# EAGLE design TSOC-ENCORE3 (EAGLE 6.6.0)
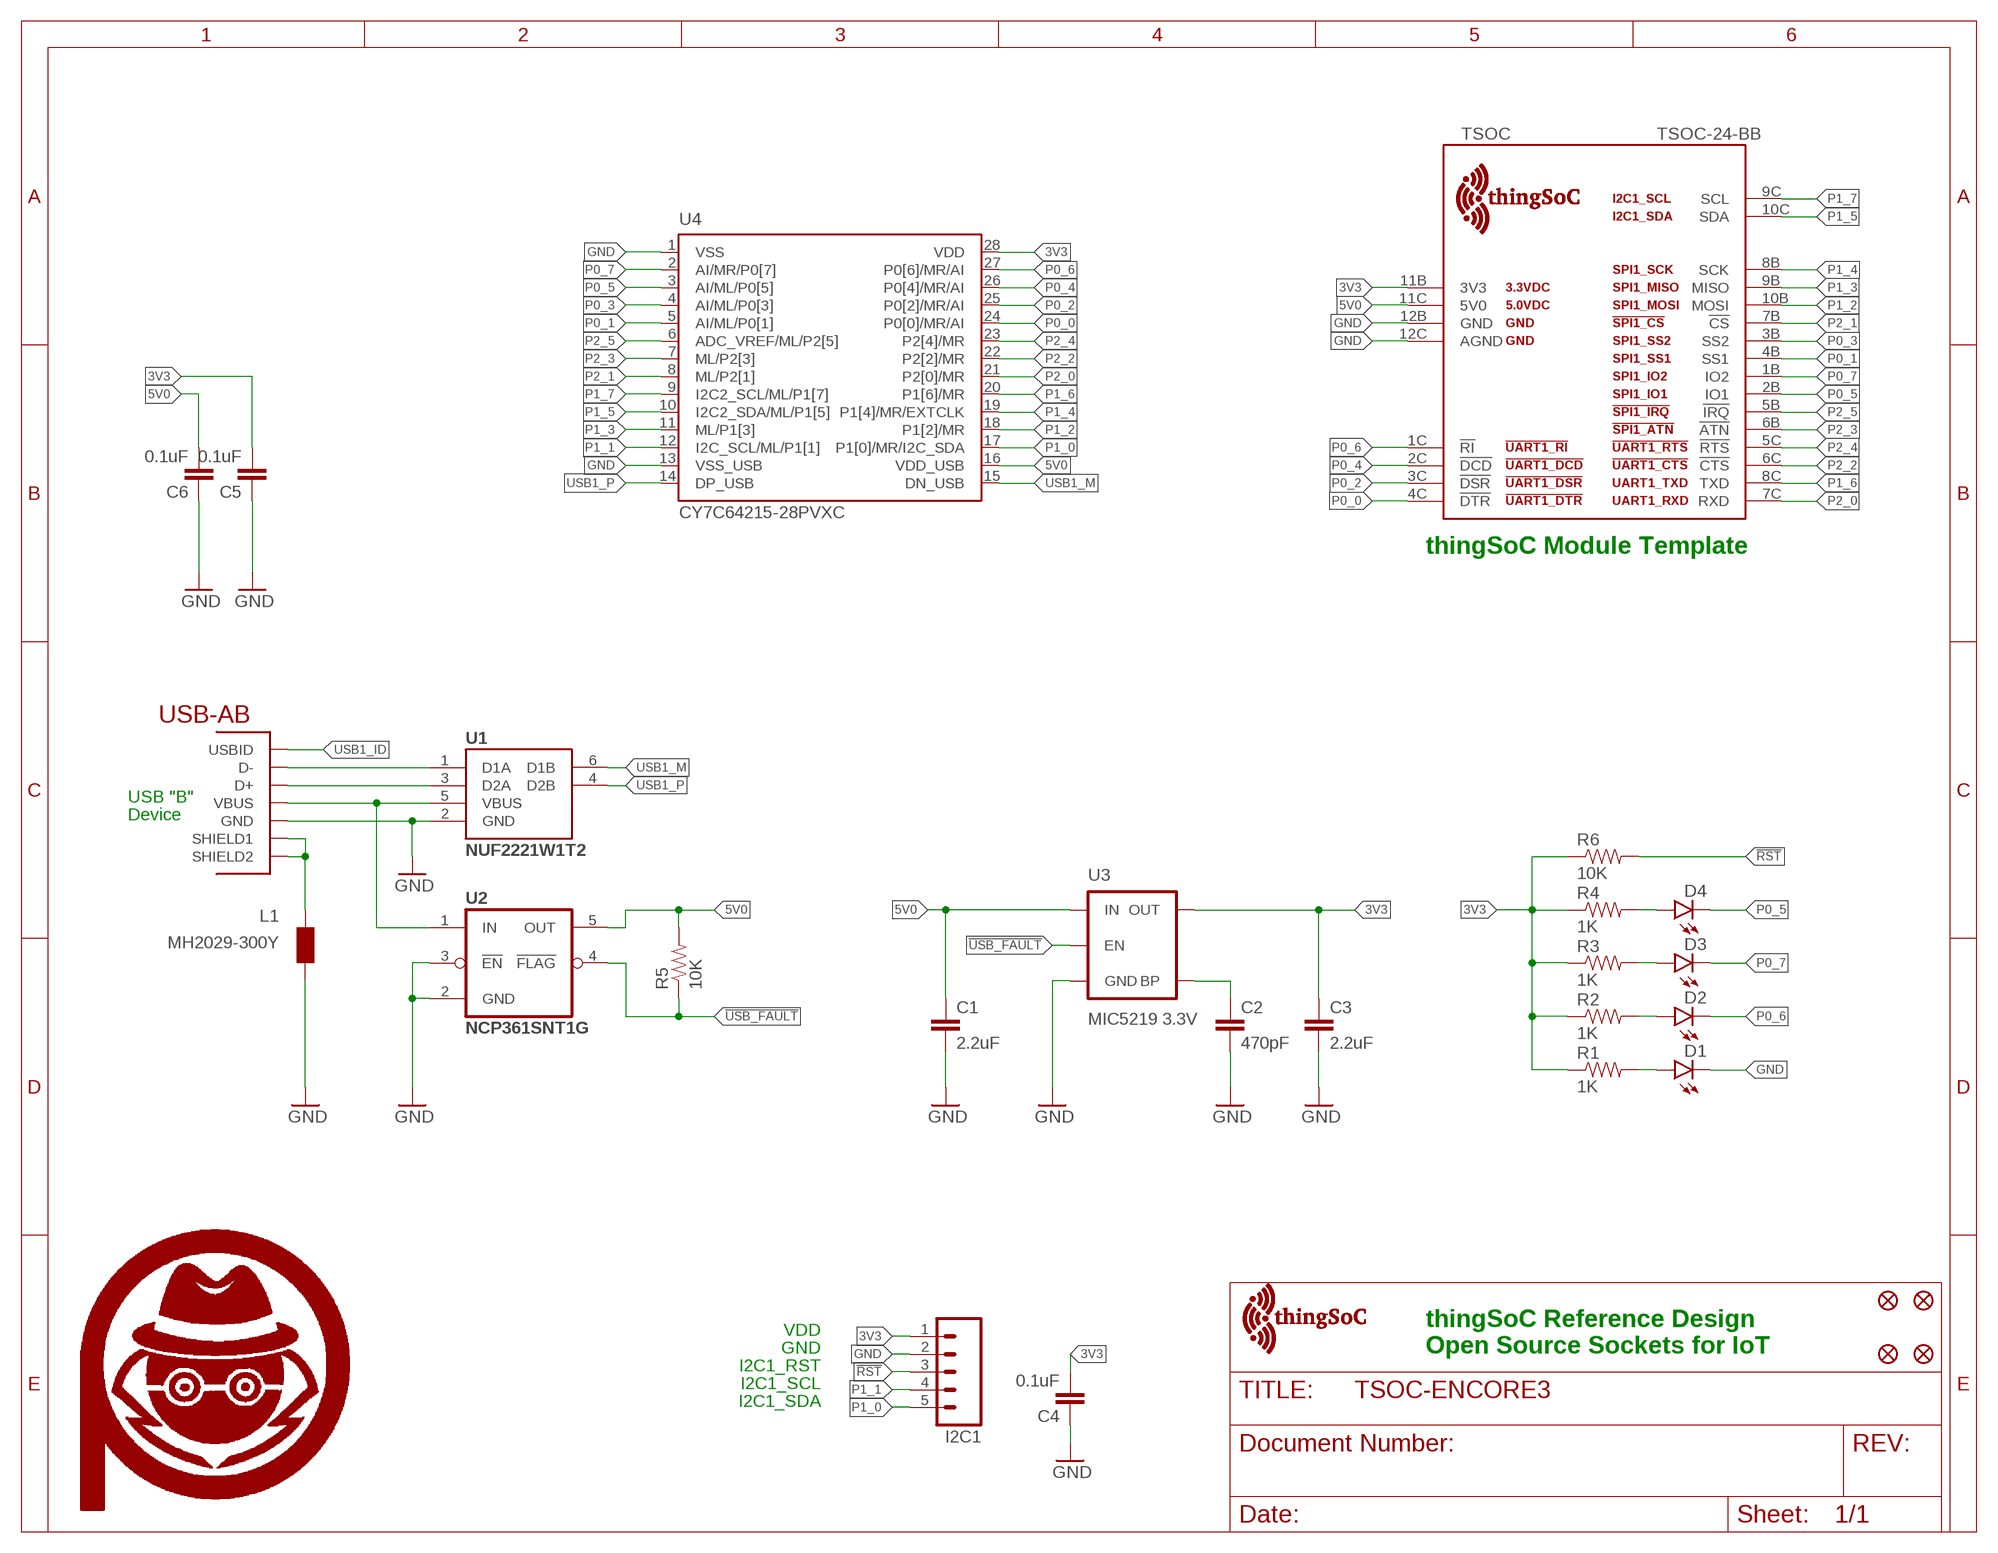
[diagram p0: schematic, sheet 1]

## Parts
C1  2.2uF  CAP0603-CAP  [0603-CAP]
C2  470pF  CAP0603-CAP  [0603-CAP]
C3  2.2uF  CAP0603-CAP  [0603-CAP]
C4  0.1uF  CAP0603-CAP  [0603-CAP]
C5  0.1uF  CAP0603-CAP  [0603-CAP]
C6  0.1uF  CAP0603-CAP  [0603-CAP]
D1  LED0603  [LED-0603]
D2  LED0603  [LED-0603]
D3  LED0603  [LED-0603]
D4  LED0603  [LED-0603]
FID1  FIDUCIAL1.5X3  [FIDUCIAL-1.5X3]
FID2  FIDUCIAL1.5X3  [FIDUCIAL-1.5X3]
FID3  FIDUCIAL1.5X3  [FIDUCIAL-1.5X3]
FID4  FIDUCIAL1.5X3  [FIDUCIAL-1.5X3]
I2C1  M05PTH  [1X05]
L1  MH2029-300Y  WE-CBF_0805  [0805]
R1  1K  RESISTOR0603-RES  [0603-RES]
R2  1K  RESISTOR0603-RES  [0603-RES]
R3  1K  RESISTOR0603-RES  [0603-RES]
R4  1K  RESISTOR0603-RES  [0603-RES]
R5  10K  RESISTOR0603-RES  [0603-RES]
R6  10K  RESISTOR0603-RES  [0603-RES]
TSOC  TSOC-24-BB  [TSOC-BB-S24]
U1  NUF2221W1T2  [SOT-363]
U2  NCP361SNT1G  [SOP95P275X110-5N]
U3  MIC5219 3.3V  V_REG_MIC52193.3V  [SOT23-5]
U4  CY7C64215-28PVXC  [SSOP28]
U$1  PA_LOGO_SYMNULL  [NULL_SYM]
U$2  TSOC-LOGO-MED  [TSOC-LOGO-MED]
U$3  TSOC-LOGO-MED  [TSOC-LOGO-MED]
USB1  USB_AB  [USB-AB-MICRO-SMD]

## Nets
3V3: C3.1 C4.2 C5.2 I2C1.1 R1.1 R2.1 R3.1 R4.1 R6.1 TSOC.11B(3V3) U3.5(OUT) U4.28(VDD)
5V0: C1.1 C6.2 R5.2 TSOC.11C(5V0) U2.5(OUT) U3.1(IN) U4.16(VDD_USB)
!RST: I2C1.3 R6.2
!USB_FAULT: R5.1 U2.4(!FLAG) U3.3(EN)
BLUE: D3.A R3.2
BYPASS: C2.1 U3.4(BP)
GND [vcc]: C1.2 C2.2 C3.2 C4.1 C5.1 C6.1 D1.C I2C1.2 L1.2 TSOC.12B(GND) TSOC.12C(AGND) U1.2(GND) U2.2(GND) U2.3(!EN) U3.2(GND) U4.1(VSS) U4.13(VSS_USB) USB1.GND
GRN: D1.A R1.2
P0_0: TSOC.4C(!DTR) U4.24(P0[0]/MR/AI)
P0_1: TSOC.4B(SS1) U4.5(AI/ML/P0[1])
P0_2: TSOC.3C(!DSR) U4.25(P0[2]/MR/AI)
P0_3: TSOC.3B(SS2) U4.4(AI/ML/P0[3])
P0_4: TSOC.2C(!DCD) U4.26(P0[4]/MR/AI)
P0_5: D4.C TSOC.2B(IO1) U4.3(AI/ML/P0[5])
P0_6: D2.C TSOC.1C(!RI) U4.27(P0[6]/MR/AI)
P0_7: D3.C TSOC.1B(IO2) U4.2(AI/MR/P0[7])
P1_0: I2C1.5 U4.17(P1[0]/MR/I2C_SDA)
P1_1: I2C1.4 U4.12(I2C_SCL/ML/P1[1])
P1_2: TSOC.10B(MOSI) U4.18(P1[2]/MR)
P1_3: TSOC.9B(MISO) U4.11(ML/P1[3])
P1_4: TSOC.8B(SCK) U4.19(P1[4]/MR/EXTCLK)
P1_5: TSOC.10C(SDA) U4.10(I2C2_SDA/ML/P1[5])
P1_6: TSOC.8C(TXD) U4.20(P1[6]/MR)
P1_7: TSOC.9C(SCL) U4.9(I2C2_SCL/ML/P1[7])
P2_0: TSOC.7C(RXD) U4.21(P2[0]/MR)
P2_1: TSOC.7B(!CS) U4.8(ML/P2[1])
P2_2: TSOC.6C(!CTS) U4.22(P2[2]/MR)
P2_3: TSOC.6B(!ATN) U4.7(ML/P2[3])
P2_4: TSOC.5C(!RTS) U4.23(P2[4]/MR)
P2_5: TSOC.5B(!IRQ) U4.6(ADC_VREF/ML/P2[5])
RED: D2.A R2.2
USB1_DM: U1.1(D1A) USB1.D-
USB1_DP: U1.3(D2A) USB1.D+
USB1_ID: USB1.ID(USBID)
USB1_M: U1.6(D1B) U4.15(DN_USB)
USB1_P: U1.4(D2B) U4.14(DP_USB)
USB1_SHIELD: L1.1 USB1.SHIELD1 USB1.SHIELD2
USB1_VBUS: U1.5(VBUS) U2.1(IN) USB1.VBUS
YEL: D4.A R4.2

## Notes on the sheet
- thingSoC Module Template
- USB "B"
- Device
- VDD
- GND
- thingSoC Reference Design
  Open Source Sockets for IoT
- I2C1_RST
- I2C1_SCL
- I2C1_SDA

## Library data of the parts
C1-C6 = PatternAgents-ProtoPads:CAP: Capacitor Standard 0603 ceramic capacitor, and 0.1" leaded capacitor.
D1-D4 = SparkFun-LED:LED: LEDs Standard schematic elements and footprints for 5mm, 3mm, 1206, and 0603 sized LEDs. 5mm - Spark Fun Electronics SKU : COM-00529 (and others)
FID1-FID4 = PatternAgents-Misc:FIDUCIAL: Fiducial Alignment Points Various fiducial points for machine vision alignment.
I2C1 = SparkFun:M05: Header 5 Standard 5-pin 0.1" header. Use with straight break away headers (SKU : PRT-00116), right angle break away headers (PRT-00553), swiss pins (PRT-00743), machine pins (PRT-00117), and female headers (PRT-00115). Molex polarized connector foot print use with SKU : PRT-08230 with associated crimp pins and housings.
L1 = wuerth-elektronik:WE-CBF: SMD EMI Suppression Ferrite Beads - excellent anti-EMI properties - low DCR - impedances till 3000 ohms - rated current up to 6 A
R1-R6 = PatternAgents-ProtoPads:RESISTOR: Resistor Basic schematic elements and footprints for 0603, 1206, and PTH resistors.
TSOC = thingSoC:TSOC-24: thingSoC Twenty-Four(24) Pin Socket Source LBR : http://www.thingsoc.com Github : https://github.com/thingsoc License : http://creativecommons.org/licenses/by-sa/4.0/ (Creative Commons 4.0) THIS SOFTWARE IS PROVIDED BY THE CONTRIBUTORS "AS IS" AND WITHOUT ANY EXPRESS OR IMPLIED WARRANTIES, INCLUDING, BUT NOT LIMITED TO, THE IMPLIED WARRANTIES OF MERCHANTABILITY AND FITNESS FOR A PARTICULAR PURPOSE ARE DISCLAIMED. IN NO EVENT SHALL THE COPYRIGHT OWNER OR CONTRIBUTORS BE LIABLE FOR ANY DIRECT, INDIRECT, INCIDENTAL, SPECIAL, EXEMPLARY, OR CONSEQUENTIAL DAMAGES (INCLUDING, BUT NOT LIMITED TO, PROCUREMENT OF SUBSTITUTE GOODS OR SERVICES; LOSS OF USE, DATA, OR PROFITS; OR BUSINESS INTERRUPTION) HOWEVER CAUSED AND ON ANY THEORY OF LIABILITY, WHETHER IN CONTRACT, STRICT LIABILITY, OR TORT (INCLUDING NEGLIGENCE OR OTHERWISE) ARISING IN ANY WAY OUT OF THE USE OF THIS SOFTWARE, EVEN IF ADVISED OF THE POSSIBILITY OF SUCH DAMAGE.
U1 = PatternAgents-OnSemi:NUF2221W1T2: NUF2221W1T2 USB ESD Protection, EMI FIlter, and Line Termination
U2 = PatternAgents-OnSemi:NCP361SNT1G: USB Positive Overvoltage Protection Controller; MPN: NCP361SNT1G; OC_FARNELL: 1642242; OC_NEWARK: 01P0135; PACKAGE: TSOP-5; SUPPLIER: ON Semiconductor
U3 = SparkFun-PowerIC:V_REG_MIC5219: V_REG MIC5219 Standard 3.3V and 5V 500mA LDO voltage regulator in SOT-23 layout. Micrel part MIC5219. BP (by-pass) pin is used to lower output noise with 470pF cap, may be left open.; PROD_ID: VREG-09872
U4 = moxdes_std:CY7C64215-28PVXC: EZ-USB ENCORE3 28SSOP
U$1 = PatternAgents-Logos:PA_LOGO_SYM: PatternAgents Logo Symbol Trademark : PatternAgents, LLC Github : https://github.com/PatternAgents/PCB_Libraries License : http://creativecommons.org/licenses/by-sa/3.0/ (Creative Commons 3.0) THIS SOFTWARE IS PROVIDED BY THE CONTRIBUTORS "AS IS" AND WITHOUT ANY EXPRESS OR IMPLIED WARRANTIES, INCLUDING, BUT NOT LIMITED TO, THE IMPLIED WARRANTIES OF MERCHANTABILITY AND FITNESS FOR A PARTICULAR PURPOSE ARE DISCLAIMED. IN NO EVENT SHALL THE COPYRIGHT OWNER OR CONTRIBUTORS BE LIABLE FOR ANY DIRECT, INDIRECT, INCIDENTAL, SPECIAL, EXEMPLARY, OR CONSEQUENTIAL DAMAGES (INCLUDING, BUT NOT LIMITED TO, PROCUREMENT OF SUBSTITUTE GOODS OR SERVICES; LOSS OF USE, DATA, OR PROFITS; OR BUSINESS INTERRUPTION) HOWEVER CAUSED AND ON ANY THEORY OF LIABILITY, WHETHER IN CONTRACT, STRICT LIABILITY, OR TORT (INCLUDING NEGLIGENCE OR OTHERWISE) ARISING IN ANY WAY OUT OF THE USE OF THIS SOFTWARE, EVEN IF ADVISED OF THE POSSIBILITY OF SUCH DAMAGE.
U$2 U$3 = thingSoC:TSOC-LOGO: thingSoC Logo Source LBR : http://www.thingsoc.com Github : https://github.com/thingsoc License : http://creativecommons.org/licenses/by-sa/4.0/ (Creative Commons 4.0) THIS SOFTWARE IS PROVIDED BY THE CONTRIBUTORS "AS IS" AND WITHOUT ANY EXPRESS OR IMPLIED WARRANTIES, INCLUDING, BUT NOT LIMITED TO, THE IMPLIED WARRANTIES OF MERCHANTABILITY AND FITNESS FOR A PARTICULAR PURPOSE ARE DISCLAIMED. IN NO EVENT SHALL THE COPYRIGHT OWNER OR CONTRIBUTORS BE LIABLE FOR ANY DIRECT, INDIRECT, INCIDENTAL, SPECIAL, EXEMPLARY, OR CONSEQUENTIAL DAMAGES (INCLUDING, BUT NOT LIMITED TO, PROCUREMENT OF SUBSTITUTE GOODS OR SERVICES; LOSS OF USE, DATA, OR PROFITS; OR BUSINESS INTERRUPTION) HOWEVER CAUSED AND ON ANY THEORY OF LIABILITY, WHETHER IN CONTRACT, STRICT LIABILITY, OR TORT (INCLUDING NEGLIGENCE OR OTHERWISE) ARISING IN ANY WAY OUT OF THE USE OF THIS SOFTWARE, EVEN IF ADVISED OF THE POSSIBILITY OF SUCH DAMAGE.
USB1 = BeeSafe:USB_AB: This is a USB AB connector that is compatible with USB OTG. i.e. this connector can serve as a host or device

## Net classes
1 vcc: width 0.254 mm

## Board
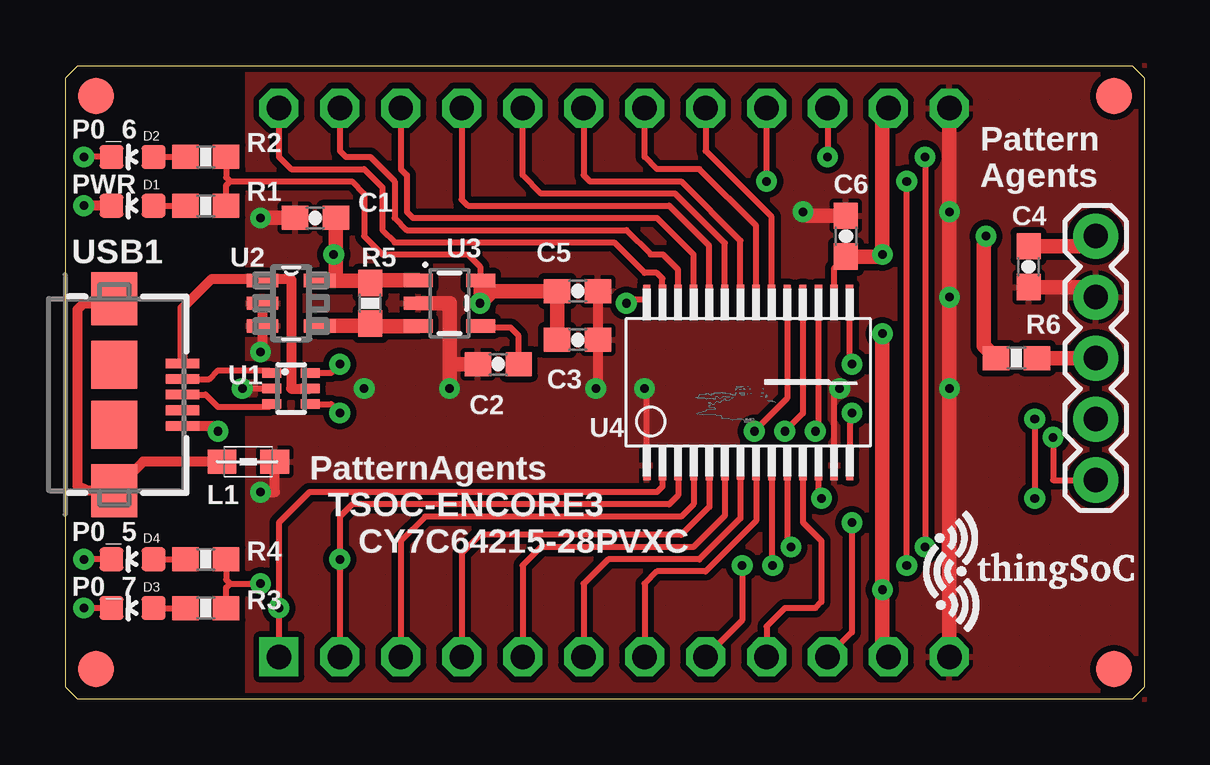
[diagram p1: board, top side]
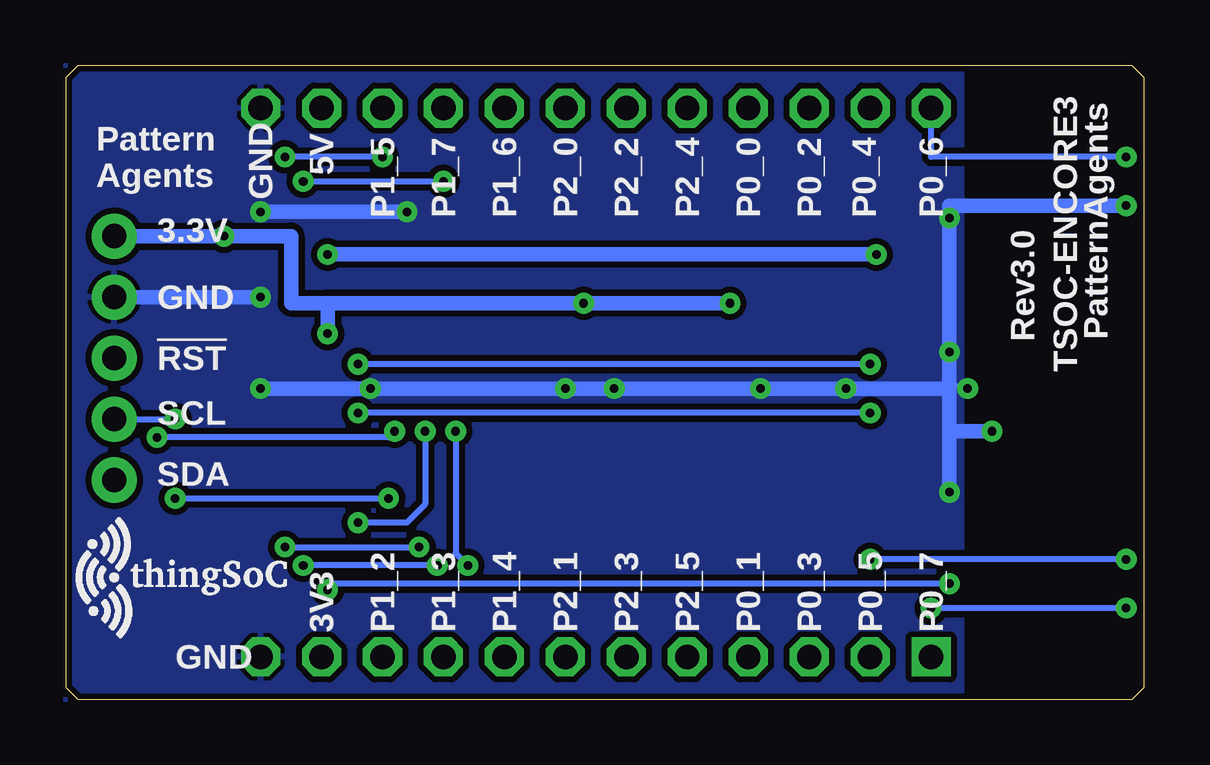
[diagram p2: board, bottom side, seen from below]

Size 44.96 x 26.42 mm. Coordinates in mm from the lower left corner, seen from the top.
Outline: 0.51,0 0,0.51 0,25.91 0.51,26.42 44.45,26.42 44.96,25.91 44.96,0.51 44.45,0 0.51,0
Copper layers (1*16): Top 0.035mm / dielectric 1.5mm / Bottom 0.035mm
Design rules "PatternAgents_7mil": minimum track width 7mil, minimum drill 14mil, track to track 7mil, track to pad 7mil, pad to pad 7mil, via to via 7mil, smd to smd 7mil, copper to edge 7mil, drill to drill 7mil, minimum pad ring 12mil, minimum via ring 10mil, stop-mask expansion 4mil, vias tented up to drill 25mil, thermal gap 7mil

### Footprints (pad centres in the part's own frame; a part is rotated, then mirrored left to right if it is on the bottom)
0603-CAP = smd 1.1 x 1: 1 -0.85,0; 2 0.85,0
LED-0603 = smd 1 x 1: A 0,-0.877; C 0,0.877
FIDUCIAL-1.5X3 = smd 1.5 x 1.5: 1 0,0
1X05 = drill 1.016 pad 1.88: 1 0,0; 2 2.54,0; 3 5.08,0; 4 7.62,0; 5 10.16,0
0805 = smd 1.2 x 1: 1 -1.1,0; 2 1.1,0
0603-RES = smd 1.1 x 1: 1 -0.85,0; 2 0.85,0
TSOC-BB-S24 = drill 1.016 square: 1B -11.43,-11.43 | drill 1.016 octagon: 1C -11.43,11.43; 2B -8.89,-11.43; 2C -8.89,11.43; 3B -6.35,-11.43; 3C -6.35,11.43; 4B -3.81,-11.43; 4C -3.81,11.43; 5B -1.27,-11.43; 5C -1.27,11.43; 6B 1.27,-11.43; 6C 1.27,11.43; 7B 3.81,-11.43; 7C 3.81,11.43; 8B 6.35,-11.43; 8C 6.35,11.43; 9B 8.89,-11.43; 9C 8.89,11.43; 10B 11.43,-11.43; 10C 11.43,11.43; 11B 13.97,-11.43; 11C 13.97,11.43; 12B 16.51,-11.43; 12C 16.51,11.43
SOT-363 = smd 0.4 x 0.8: 1 -0.65,-0.8; 2 0,-0.8; 3 0.65,-0.8; 4 0.65,0.8; 5 0,0.8; 6 -0.65,0.8
SOP95P275X110-5N = smd 1.321 x 0.559: 1 -1.194,0.94; 2 -1.194,0; 3 -1.194,-0.94; 4 1.194,-0.94; 5 1.194,0.94
SOT23-5 = smd 0.55 x 1.2: 1 -0.95,-1.3; 2 0,-1.3; 3 0.95,-1.3; 4 0.95,1.3; 5 -0.95,1.3
SSOP28 = smd 0.305 x 1.245: 1 4.224,3.441; 2 3.574,3.441; 3 2.924,3.441; 4 2.274,3.441; 5 1.624,3.441; 6 0.974,3.441; 7 0.325,3.44; 8 -0.326,3.441; 9 -0.976,3.441; 10 -1.626,3.441; 11 -2.276,3.441; 12 -2.926,3.441; 13 -3.576,3.441; 14 -4.226,3.441; 15 -4.224,-3.441; 16 -3.574,-3.441; 17 -2.924,-3.441; 18 -2.274,-3.441; 19 -1.624,-3.441; 20 -0.974,-3.441; 21 -0.324,-3.441; 22 0.326,-3.441; 23 0.976,-3.441; 24 1.626,-3.441; 25 2.276,-3.441; 26 2.926,-3.441; 27 3.576,-3.441; 28 4.226,-3.441
USB-AB-MICRO-SMD = smd 1.4 x 0.4: D+ 2.85,0; D- 2.85,0.65; GND 2.85,-1.3; ID 2.85,-0.65; VBUS 2.85,1.3 | smd 1.9 x 2: P$6 0,1.25; P$7 0,-1.25 | smd 1.9 x 2.2: SHIELD1 0,4; SHIELD2 0,-4

### Placement (x,y rotation side)
C1  10.41,20.07 180 top
C2  18.03,13.97 180 top
C3  21.34,14.99 0 top
C4  40.13,18.03 90 top
C5  21.34,17.02 180 top
C6  32.51,19.3 270 top
D1  2.79,20.57 90 top
D2  2.79,22.61 90 top
D3  2.79,3.81 90 top
D4  2.79,5.84 90 top
FID1  1.27,1.27 0 top
FID2  43.69,1.27 0 top
FID3  1.27,25.15 0 top
FID4  43.69,25.15 0 top
I2C1  42.93,19.3 270 top
L1  7.62,9.91 0 top
R1  5.84,20.57 180 top
R2  5.84,22.61 180 top
R3  5.84,3.81 180 top
R4  5.84,5.84 180 top
R5  12.7,16.51 90 top
R6  39.62,14.22 0 top
TSOC  20.32,13.21 0 top
U1  9.4,12.95 270 top
U2  9.4,16.51 0 top
U3  16,16.51 270 top
U4  28.45,13.21 180 top
U$1  40.89,2.79 0 top
U$2  37.34,5.33 0 top
U$3  42.93,5.08 0 bottom
USB1  2.03,12.7 0 top

### Tracks (layer width: path | path; a pad name or v marks a point on that pad's centre or on a via)
3V3  (via drill 0.36)
  Top 0.254: R2.1 6.69,21.76 6.86,21.59 | 6.86,21.59 11.94,21.59 12.45,21.08 12.45,19.3 13.21,18.54 16.76,18.54 17.27,18.03 17.27,17.49 U3.5 | R1.1 6.69,21.42 6.86,21.59 | U4.28 23.51,16.65 v23.37,16.51 | R3.1 6.69,4.66 6.86,4.83 | 6.86,4.83 v8.13,4.83 | R4.1 6.69,4.99 6.86,4.83
  Top 0.61: U3.5 17.3,16.54 v17.27,16.51 17.78,17.02 C5.2 C3.1 | v34.04,15.24 v34.04,4.57 34.04,1.78 TSOC.11B | v38.35,19.3 38.27,18.88 38.27,14.73 R6.1 | C4.2 42.51,18.88 I2C1.1
  Bottom 0.254: v8.13,4.83 34.04,4.83 v34.04,4.57
  Bottom 0.61: v17.27,16.51 v23.37,16.51 34.04,16.51 | 34.04,16.51 v34.04,15.24 | I2C1.1 v38.35,19.3 35.56,19.3 35.56,16.51 34.04,16.51
5V0  (via drill 0.36)
  Top 0.254: U4.16 32.02,17.96 C6.2
  Top 0.61: C1.1 11.26,18.63 v11.18,18.54 11.26,18.45 11.26,17.62 11.1,17.45 U2.5 12.61,17.45 R5.2 12.8,17.46 U3.1 | C6.2 34.04,18.45 v34.04,18.54 34.04,24.38 TSOC.11C
  Bottom 0.61: v11.18,18.54 v34.04,18.54
!RST
  Top 0.61: R6.2 I2C1.3
!USB_FAULT
  Top 0.61: U2.4 12.61,15.57 R5.1 12.8,15.56 U3.3
BLUE
  Top 0.254: D3.A R3.2
BYPASS
  Top 0.254: C2.1 18.88,15.15 18.54,15.49 17.37,15.49 U3.4
GND  (via drill 0.36)
  Top 0.254: U4.1 24.22,12.61 v24.13,12.95 | U1.2 v7.37,12.95 | U4.13 32.02,12.72 v32.26,12.95
  Top 0.406: C5.1 C3.2 22.19,13.04 v22.1,12.95 | v8.13,8.64 8.72,8.64 L1.2 | USB1.GND 6.13,11.4 v6.35,11.18 | U2.2 U2.3 8.2,14.55 v8.13,14.48 | D1.C v0.76,20.57
  Top 0.61: TSOC.12B v36.83,12.95 v36.83,16.76 v36.83,20.32 TSOC.12C | C1.2 v8.13,20.07 | U3.2 16,16.51 16,13.97 | 16,13.97 v16,12.95 | C2.2 16,13.97 | C4.1 42.51,17.18 I2C1.2 | C6.1 30.9,20.15 v30.73,20.32
  Bottom 0.254: v7.37,12.95 7.62,12.95 8.13,13.21
  Bottom 0.61: 8.13,12.95 8.13,11.18 | 8.13,11.18 v8.13,8.64 | 8.13,12.95 v12.45,12.95 v16,12.95 v22.1,12.95 v24.13,12.95 v32.26,12.95 v36.83,12.95 | 8.13,12.95 8.13,13.21 v8.13,14.48 v8.13,20.07 8.13,20.57 v0.76,20.57 | v6.35,11.18 8.13,11.18 | I2C1.2 v36.83,16.76 | v30.73,20.32 v36.83,20.32
  pour Top (isolate 0.254, hatched): 7.62,0 7.62,26.42 44.96,26.42 44.96,0
  pour Bottom (isolate 0.254, hatched): 7.62,0 7.62,26.42 44.96,26.42 44.96,0
GRN
  Top 0.254: D1.A R1.2
P0_0
  Top 0.254: TSOC.4C 16.51,20.83 16.76,20.57 25.15,20.57 26.82,18.9 U4.24
P0_1
  Top 0.254: U4.5 26.82,8.03 25.65,6.86 17.27,6.86 16.51,6.1 TSOC.4B
P0_2
  Top 0.254: TSOC.3C 13.97,22.1 14.22,21.84 14.22,20.32 14.48,20.07 24.64,20.07 26.16,18.54 U4.25
P0_3
  Top 0.254: U4.4 26.17,8.14 25.65,7.62 14.99,7.62 13.97,6.6 TSOC.3B
P0_4
  Top 0.254: TSOC.2C 11.43,22.86 11.68,22.61 12.7,22.61 13.72,21.59 13.72,20.07 14.22,19.56 23.37,19.56 24.38,18.54 24.89,18.54 25.52,17.91 U4.26
P0_5  (via drill 0.36)
  Top 0.254: D4.C v0.76,5.84 | TSOC.2B v11.43,5.84 11.43,7.62 11.94,8.13 25.15,8.13 25.52,8.51 U4.3
  Bottom 0.254: v0.76,5.84 v11.43,5.84
P0_6  (via drill 0.36)
  Top 0.254: D2.C v0.76,22.61 | TSOC.1C 8.89,22.61 9.4,22.1 12.45,22.1 13.21,21.34 13.21,19.56 13.72,19.05 22.86,19.05 24.13,17.78 24.64,17.78 24.87,17.55 U4.27
  Bottom 0.254: v0.76,22.61 8.89,22.61 TSOC.1C
P0_7  (via drill 0.36)
  Top 0.254: D3.C v0.76,3.81 | TSOC.1B v8.89,3.81 8.89,7.37 10.16,8.64 24.64,8.64 24.87,8.87 U4.2
  Bottom 0.254: v0.76,3.81 v8.89,3.81
P1_0  (via drill 0.36)
  Top 0.254: U4.17 31.37,11.31 v31.24,11.18 | v41.15,10.92 41.15,9.14 I2C1.5
  Bottom 0.254: v31.24,11.18 31.5,10.92 v41.15,10.92
P1_1  (via drill 0.36)
  Top 0.254: v40.39,11.68 v40.39,8.38 | U4.12 31.37,8.5 v31.5,8.38
  Bottom 0.254: I2C1.4 v40.39,11.68 | v40.39,8.38 v31.5,8.38
P1_2  (via drill 0.36)
  Top 0.254: U4.18 30.72,11.93 v29.97,11.18 | v32.77,7.37 32.77,2.79 TSOC.10B
  Bottom 0.254: v29.97,11.18 29.97,8.13 30.73,7.37 v32.77,7.37
P1_3
  Top 0.254: TSOC.9B 29.21,3.05 29.97,3.81 31.24,3.81 31.5,4.06 31.5,6.6 30.72,7.38 U4.11
P1_4  (via drill 0.36)
  Top 0.254: U4.19 30.07,12.55 v28.7,11.18 | v28.19,5.59 28.19,3.3 TSOC.8B
  Bottom 0.254: v28.7,11.18 28.7,6.1 v28.19,5.59
P1_5  (via drill 0.36)
  Top 0.254: TSOC.10C v31.75,22.61 | v35.81,22.61 v35.81,6.35 | U4.10 30.07,6.5 v30.23,6.35
  Bottom 0.254: v31.75,22.61 v35.81,22.61 | v35.81,6.35 v30.23,6.35
P1_6
  Top 0.254: TSOC.8C 26.67,22.86 29.42,20.11 U4.20
P1_7  (via drill 0.36)
  Top 0.254: v35.05,5.59 v35.05,21.59 | v29.21,21.59 TSOC.9C | U4.9 29.42,5.63 v29.46,5.59
  Bottom 0.254: v29.46,5.59 v35.05,5.59 | v35.05,21.59 v29.21,21.59
P2_0
  Top 0.254: U4.21 28.77,19.74 26.42,22.1 24.64,22.1 24.13,22.61 TSOC.7C
P2_1
  Top 0.254: U4.8 28.77,7.44 26.67,5.33 24.64,5.33 24.13,4.83 TSOC.7B
P2_2
  Top 0.254: TSOC.6C 21.59,21.84 21.84,21.59 25.65,21.59 28.12,19.12 U4.22
P2_3
  Top 0.254: U4.7 28.12,7.55 26.42,5.84 22.61,5.84 21.59,4.83 TSOC.6B
P2_4
  Top 0.254: U4.23 27.47,19.01 25.4,21.08 19.81,21.08 19.05,21.84 TSOC.5C
P2_5
  Top 0.254: U4.6 27.47,7.66 26.16,6.35 19.81,6.35 19.05,5.59 TSOC.5B
RED
  Top 0.254: D2.A R2.2
USB1_DM
  Top 0.254: USB1.D- 5.98,13.35 6.35,13.72 8.49,13.72 U1.1
USB1_DP
  Top 0.254: USB1.D+ 5.84,12.7 6.35,12.19 8.49,12.19 U1.3
USB1_M  (via drill 0.36)
  Top 0.254: v32.77,13.97 32.67,13.97 U4.15 | U1.6 11.06,13.6 v11.43,13.97
  Bottom 0.254: v11.43,13.97 v32.77,13.97
USB1_P  (via drill 0.36)
  Top 0.254: v32.77,11.94 32.67,12.19 U4.14 | U1.4 11.06,12.3 v11.43,11.94
  Bottom 0.254: v11.43,11.94 v32.77,11.94
USB1_SHIELD
  Top 0.406: L1.1 3.24,9.91 USB1.SHIELD2 0.95,8.7 0.51,8.89 0.51,16.26 0.76,16.51 1.84,16.51 USB1.SHIELD1
USB1_VBUS
  Top 0.406: USB1.VBUS 4.88,16.31 6.1,17.53 8.38,17.53 | 8.38,17.53 9.4,17.53 9.4,12.95 U1.5 | U2.1 8.31,17.45 8.38,17.53
YEL
  Top 0.254: D4.A R4.2

### Text on the board
tPlace: P0_6 | PWR | Pattern / Agents | PatternAgents | TSOC-ENCORE3 | P0_5 | CY7C64215-28PVXC | P0_7
bPlace: PatternAgents | TSOC-ENCORE3 | 5V | GND | Pattern / Agents | Rev3.0 | P0_6 | P0_4 | P0_2 | P0_0 | P2_4 | P2_2 | P2_0 | P1_6 | P1_7 | P1_5 | 3.3V | GND | !RST | SCL | SDA | P0_7 | P0_5 | P0_3 | P0_1 | P2_5 | P2_3 | P2_1 | P1_4 | P1_3 | P1_2 | 3V3 | GND